# EAGLE design dop (EAGLE 9.4.2)
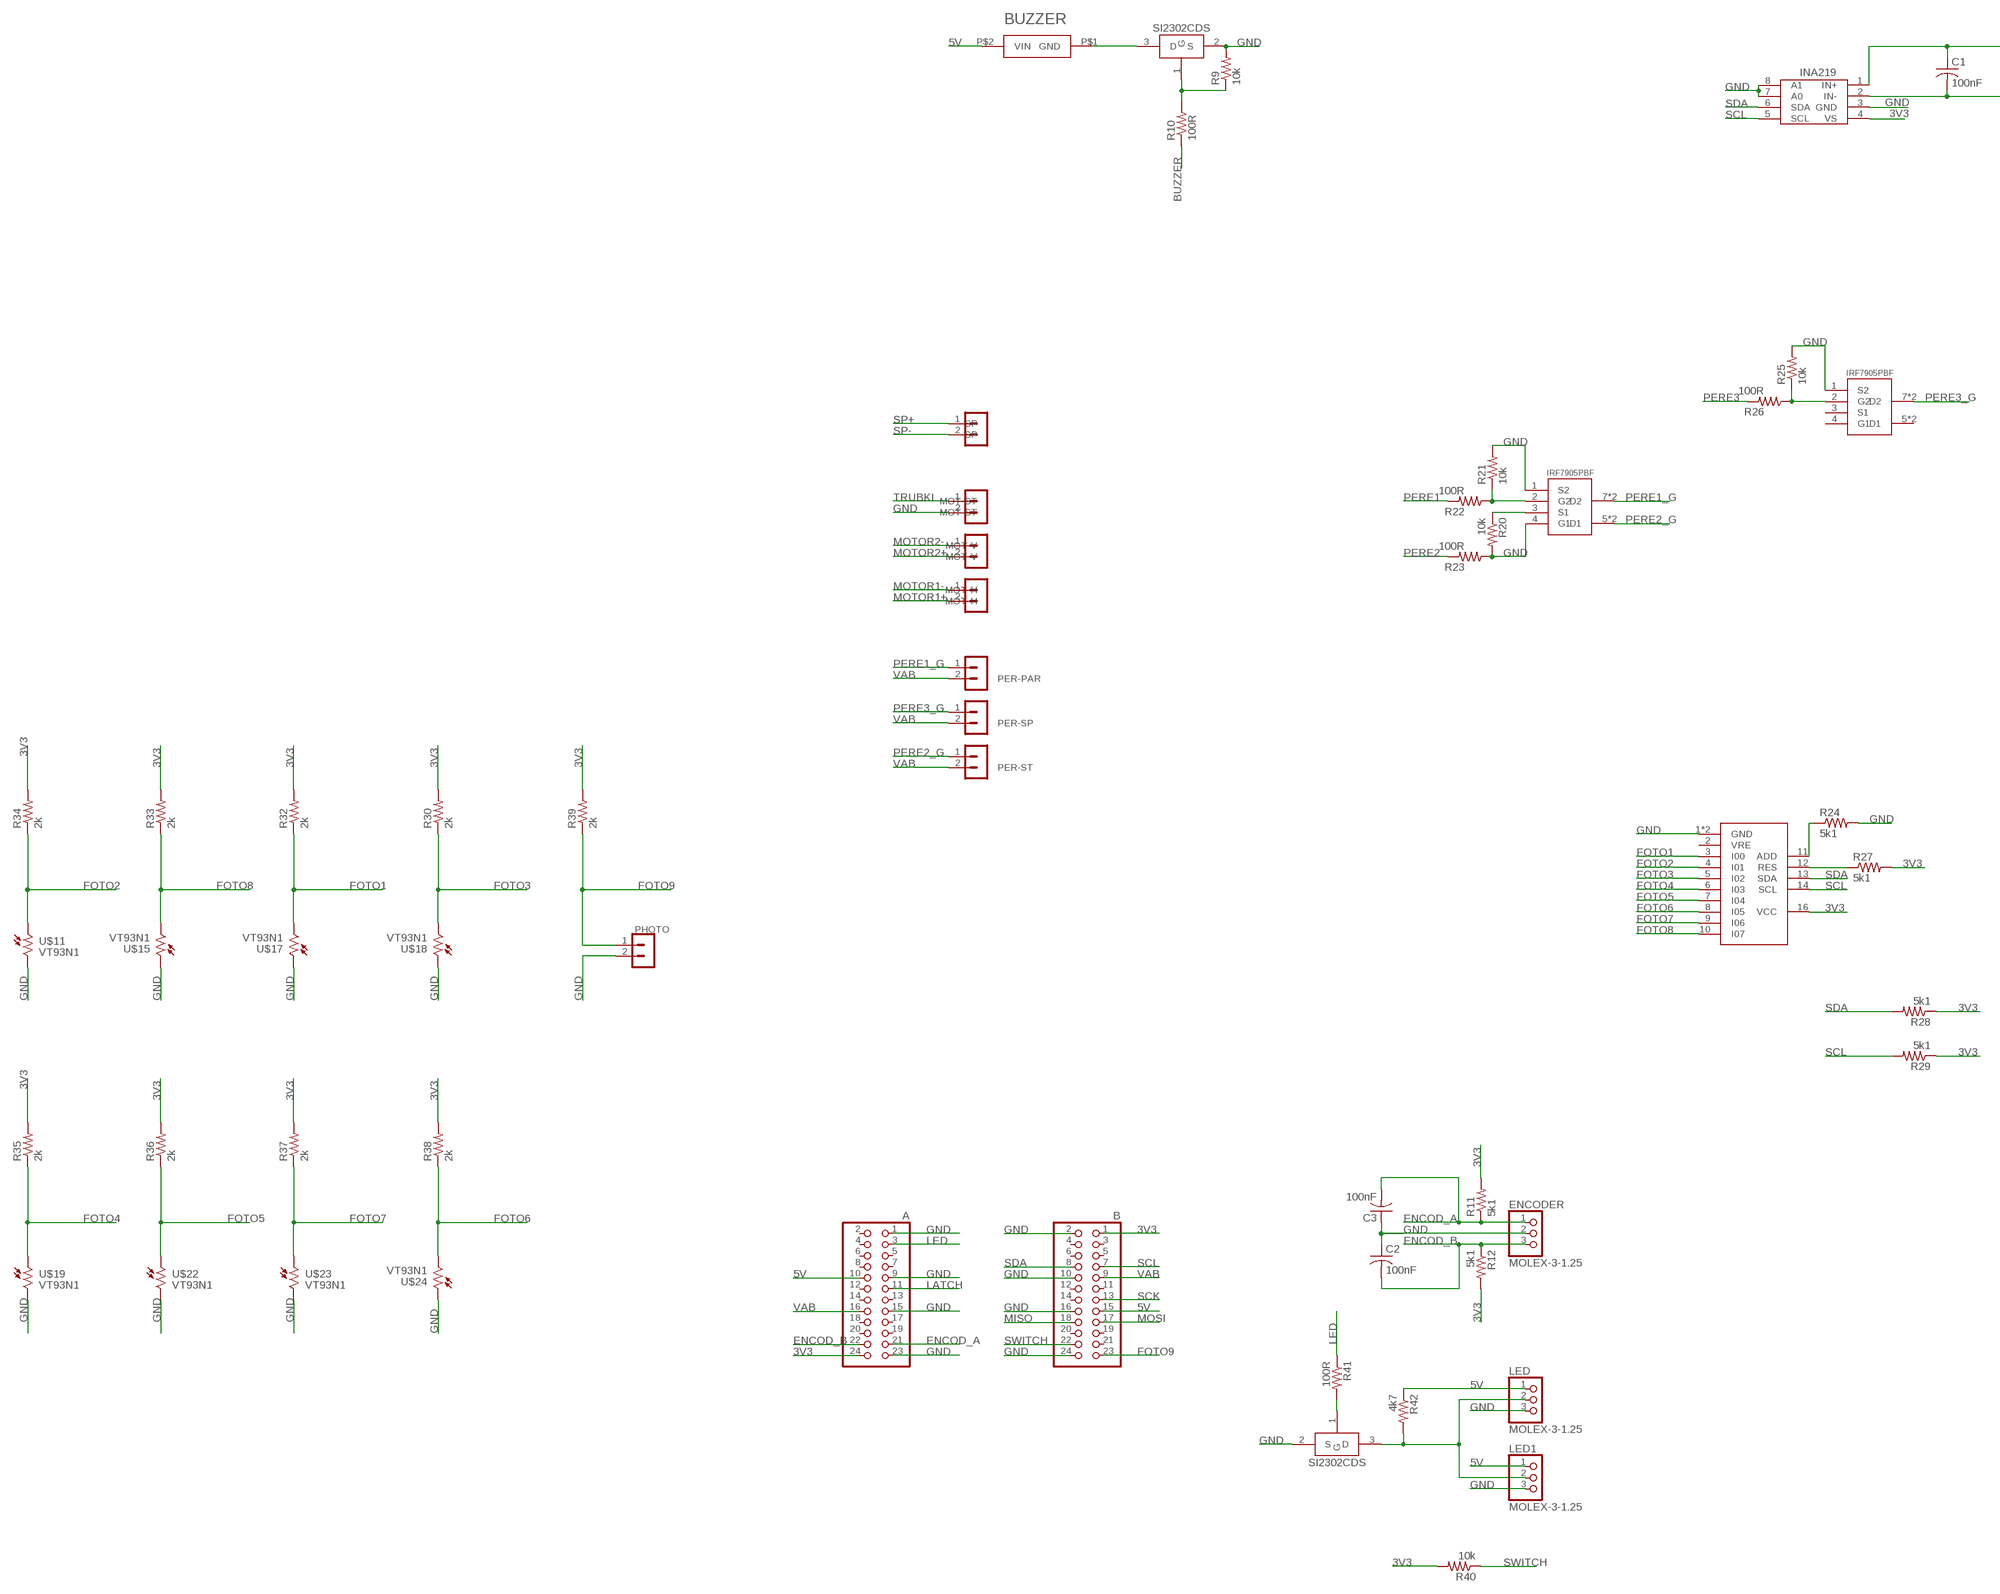
[diagram p0: schematic, sheet 1, part 1 of 2]
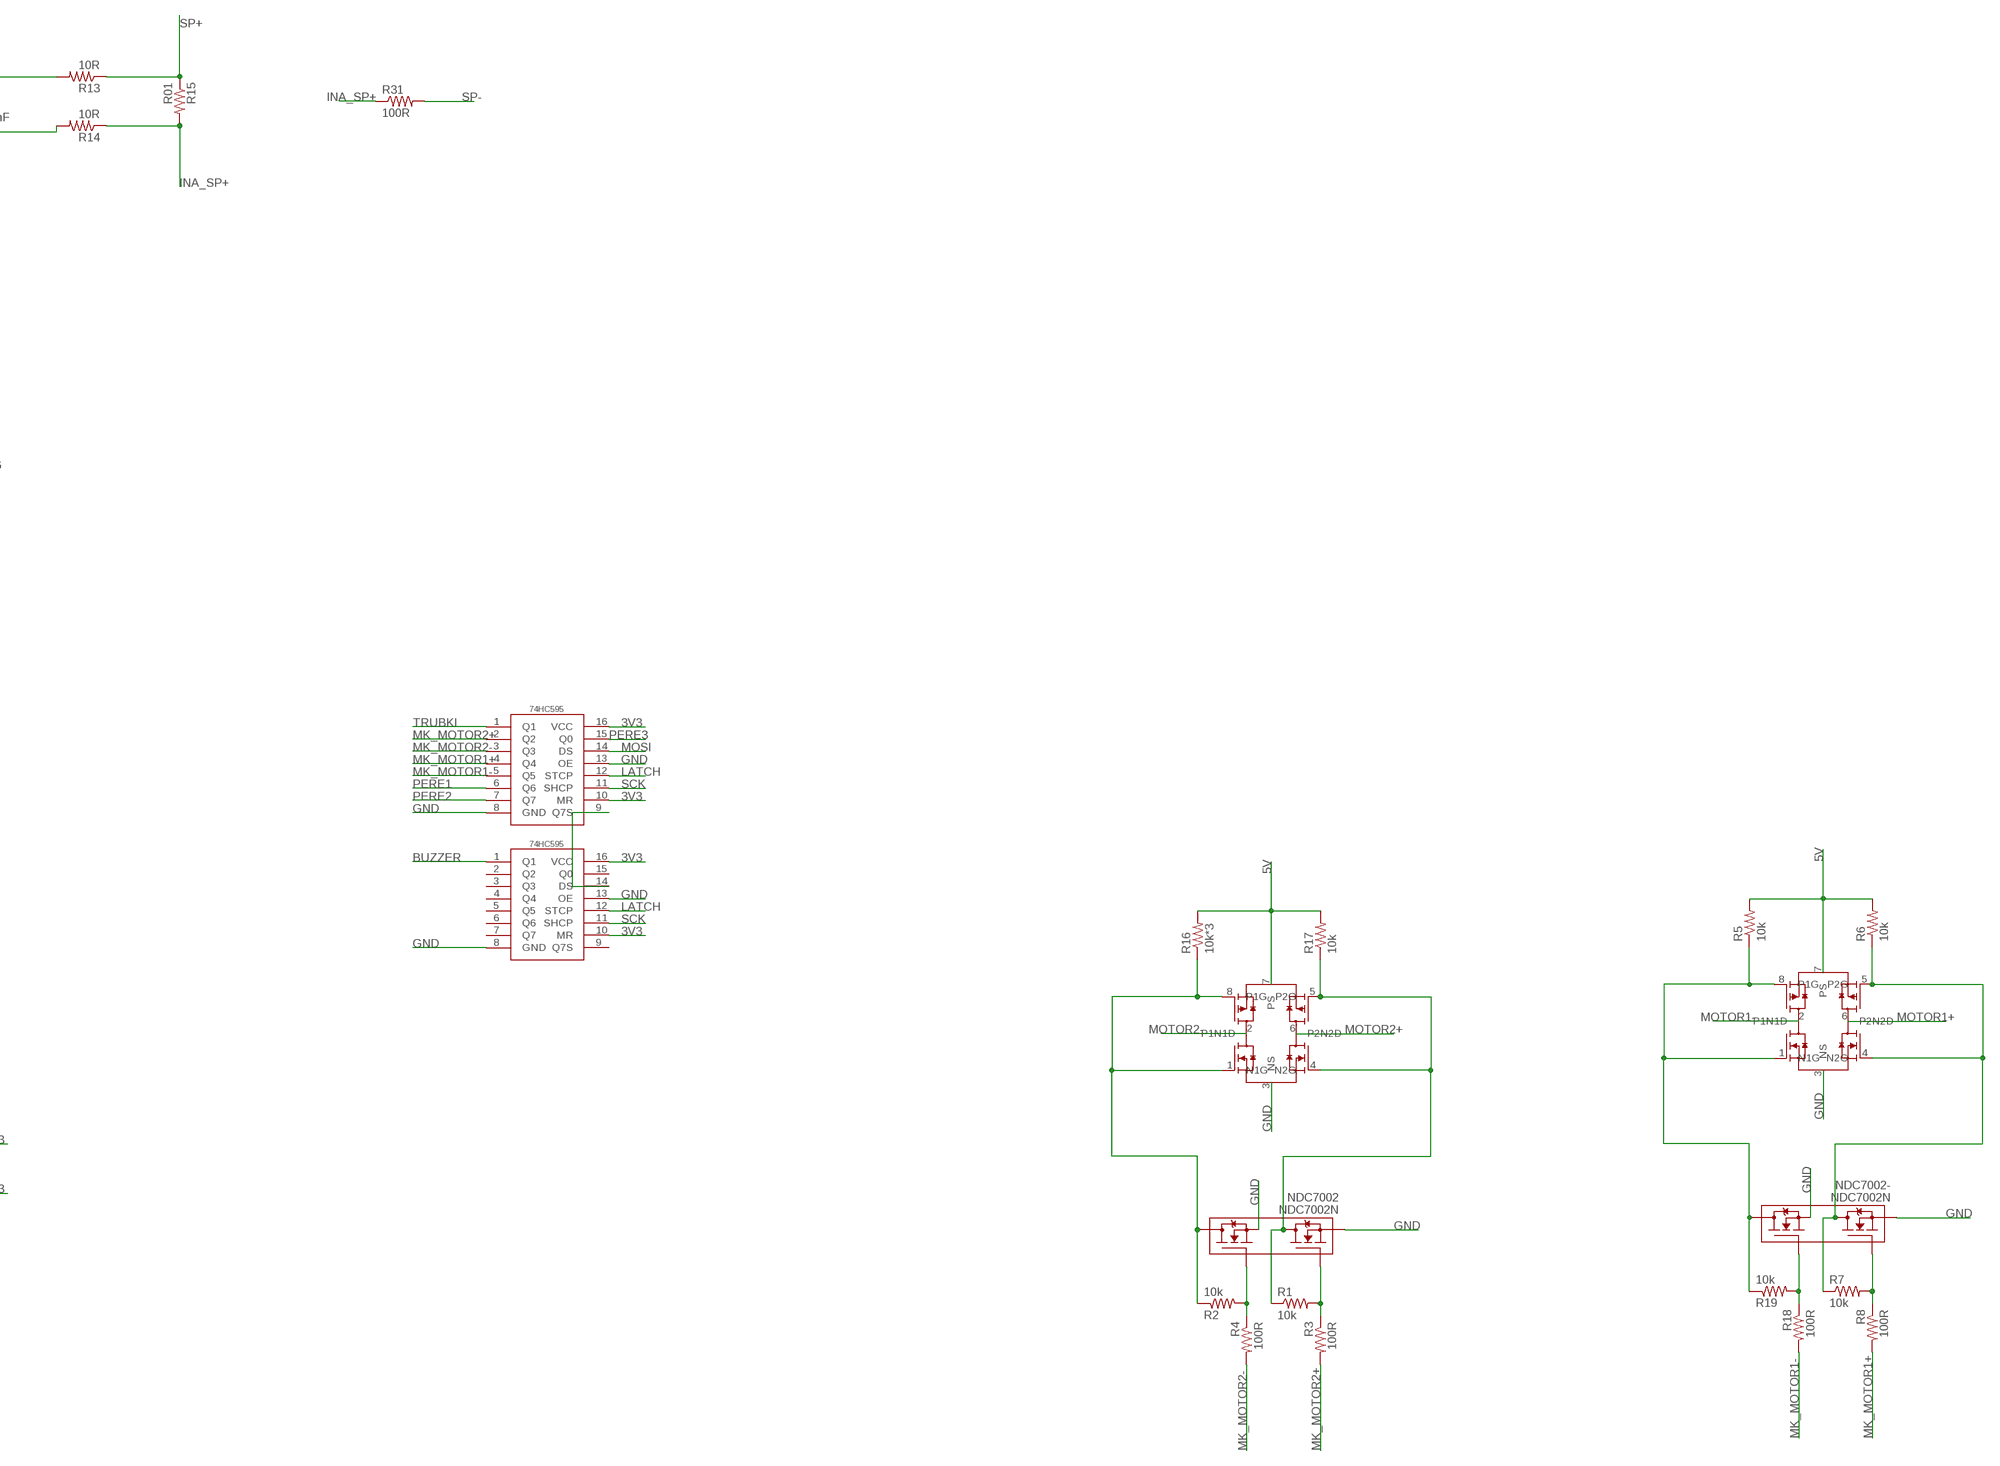
[diagram p1: schematic, sheet 1, part 2 of 2]

## Parts
74HC595  74HC595  [TSSOP16]
74HC595-  74HC595  [TSSOP16]
A  PINHD-2X12  [2X12]
AD5593  AD5593  [AD5593]
AP9930  AP9930GM  [SO8]
AP9930-  AP9930GM  [SO8]
B  PINHD-2X12  [2X12]
BUZZER  BUZZERS8R6  [BUZZER-S8R12]
C1  100nF  C-USC0603  [C0603]
C2  100nF  C-USC0603  [C0603]
C3  100nF  C-USC0603  [C0603]
ENCODER  MOLEX-3-1.25  [53047-03]
INA  INA219AID  [SOT23-8]
IRF7905  IRF7905  [SO8]
IRF7905-  IRF7905  [SO8]
LED  MOLEX-3-1.25  [53047-03]
LED1  MOLEX-3-1.25  [53047-03]
MOT-H  MOLEX-2-1.25  [53047-02]
MOT-ST  MOLEX-2-1.25  [53047-02]
MOT-V  MOLEX-2-1.25  [53047-02]
NDC7002  NDC7002N  [SOT23-6]
NDC7002-  NDC7002N  [SOT23-6]
PER-PAR  JST-2-2.5  [JST-2-2.5]
PER-SP  JST-2-2.5  [JST-2-2.5]
PER-ST  JST-2-2.5  [JST-2-2.5]
PHOTO  MOLEX-2-1.25  [53047-02]
R1  10k  R-US_R0603  [R0603]
R2  10k  R-US_R0603  [R0603]
R3  100R  R-US_R0603  [R0603]
R4  100R  R-US_R0603  [R0603]
R5  10k  R-US_R0603  [R0603]
R6  10k  R-US_R0603  [R0603]
R7  10k  R-US_R0603  [R0603]
R8  100R  R-US_R0603  [R0603]
R9  10k  R-US_R0603  [R0603]
R10  100R  R-US_R0603  [R0603]
R11  5k1  R-US_R0603  [R0603]
R12  5k1  R-US_R0603  [R0603]
R13  10R  R-US_R0603  [R0603]
R14  10R  R-US_R0603  [R0603]
R15  R01  R-US_R2512  [R2512]
R16  10k*3  R-US_R0603  [R0603]
R17  10k  R-US_R0603  [R0603]
R18  100R  R-US_R0603  [R0603]
R19  10k  R-US_R0603  [R0603]
R20  10k  R-US_R0603  [R0603]
R21  10k  R-US_R0603  [R0603]
R22  100R  R-US_R0603  [R0603]
R23  100R  R-US_R0603  [R0603]
R24  5k1  R-US_R0603  [R0603]
R25  10k  R-US_R0603  [R0603]
R26  100R  R-US_R0603  [R0603]
R27  5k1  R-US_R0603  [R0603]
R28  5k1  R-US_R0603  [R0603]
R29  5k1  R-US_R0603  [R0603]
R30  2k  R-US_R0603  [R0603]
R31  100R  R-US_0207/15  [0207/15]
R32  2k  R-US_R0603  [R0603]
R33  2k  R-US_R0603  [R0603]
R34  2k  R-US_R0603  [R0603]
R35  2k  R-US_R0603  [R0603]
R36  2k  R-US_R0603  [R0603]
R37  2k  R-US_R0603  [R0603]
R38  2k  R-US_R0603  [R0603]
R39  2k  R-US_R0603  [R0603]
R40  10k  R-US_R0603  [R0603]
R41  100R  R-US_R0603  [R0603]
R42  4k7  R-US_R0603  [R0603]
SI2302  SI2302CDS  [SOT23-3]
SI2302-  SI2302CDS  [SOT23-3]
SP  MOLEX-2-1.25  [53047-02]
U$11  VT93N1  [VT93N1]
U$15  VT93N1  [VT93N1]
U$17  VT93N1  [VT93N1]
U$18  VT93N1  [VT93N1]
U$19  VT93N1  [VT93N1]
U$22  VT93N1  [VT93N1]
U$23  VT93N1  [VT93N1]
U$24  VT93N1  [VT93N1]

## Nets
3V3: 74HC595-.10(MR) 74HC595-.16(VCC) 74HC595.10(MR) 74HC595.16(VCC) A.24 AD5593.16(VCC) B.1 INA.4(VS) R11.2 R12.2 R27.2 R28.1 R29.1 R30.2 R32.2 R33.2 R34.2 R35.2 R36.2 R37.2 R38.2 R39.2 R40.2
5V: A.10 AP9930-.7(PS) AP9930.7(PS) B.15 BUZZER.P$2(VIN) LED1.1 LED.1 R5.2 R6.2 R16.2 R17.2 R42.1
BUZZER: 74HC595-.1(Q1) R10.1
ENCOD_A: A.21 C3.2 ENCODER.1 R11.1
ENCOD_B: A.22 C2.2 ENCODER.3 R12.1
FOTO1: AD5593.3(I00) R32.1 U$17.P$2
FOTO2: AD5593.4(I01) R34.1 U$11.P$1
FOTO3: AD5593.5(I02) R30.1 U$18.P$2
FOTO4: AD5593.6(I03) R35.1 U$19.P$1
FOTO5: AD5593.7(I04) R36.1 U$22.P$1
FOTO6: AD5593.8(I05) R38.1 U$24.P$2
FOTO7: AD5593.9(I06) R37.1 U$23.P$1
FOTO8: AD5593.10(I07) R33.1 U$15.P$2
FOTO9: B.23 PHOTO.1 R39.1
GND: 74HC595-.8(GND) 74HC595-.13(OE) 74HC595.8(GND) 74HC595.13(OE) A.1 A.9 A.15 A.23 AD5593.1(GND) AD5593.15(GND) AP9930-.3(NS) AP9930.3(NS) B.2 B.10 B.16 B.24 C2.1 C3.1 ENCODER.2 INA.3(GND) INA.7(A0) INA.8(A1) IRF7905-.1(S2) IRF7905.1(S2) IRF7905.4(G1) LED1.3 LED.3 MOT-ST.2 NDC7002-.2(S2) NDC7002-.5(S1) NDC7002.2(S2) NDC7002.5(S1) PHOTO.2 R9.2 R20.2 R21.2 R23.1 R24.2 R25.2 SI2302-.2(S) SI2302.2(S) U$11.P$2 U$15.P$1 U$17.P$1 U$18.P$1 U$19.P$2 U$22.P$2 U$23.P$2 U$24.P$1
INA_SP+: R14.1 R15.2 R31.1
LATCH: 74HC595-.12(STCP) 74HC595.12(STCP) A.11
LED: A.3 R41.1
MISO: B.18
MK_MOTOR1+: 74HC595.4(Q4) R8.2
MK_MOTOR1-: 74HC595.5(Q5) R18.2
MK_MOTOR2+: 74HC595.2(Q2) R3.2
MK_MOTOR2-: 74HC595.3(Q3) R4.2
MOSI: 74HC595.14(DS) B.17
MOTOR1+: AP9930-.6(P2N2D) MOT-H.2
MOTOR1-: AP9930-.2(P1N1D) MOT-H.1
MOTOR2+: AP9930.6(P2N2D) MOT-V.2
MOTOR2-: AP9930.2(P1N1D) MOT-V.1
N$1: NDC7002.3(G2) R1.2 R3.1
N$2: AP9930.1(N1G) AP9930.8(P1G) NDC7002.6(D1) R2.1 R16.1
N$3: NDC7002.1(G1) R2.2 R4.1
N$4: AP9930.4(N2G) AP9930.5(P2G) NDC7002.4(D2) R1.1 R17.1
N$5: AP9930-.1(N1G) AP9930-.8(P1G) NDC7002-.6(D1) R5.1 R19.1
N$6: NDC7002-.3(G2) R7.2 R8.1
N$7: NDC7002-.1(G1) R18.1 R19.2
N$8: AP9930-.4(N2G) AP9930-.5(P2G) NDC7002-.4(D2) R6.1 R7.1
N$9: IRF7905.3(S1) R20.1
N$12: IRF7905.2(G2) R21.1 R22.1
N$13: BUZZER.P$1(GND) SI2302-.3(D)
N$14: R9.1 R10.2 SI2302-.1(G)
N$15: C1.1 INA.1(IN+) R13.2
N$16: C1.2 INA.2(IN-) R14.2
N$17: R41.2 SI2302.1(G)
N$18: AD5593.12(RES) R27.1
N$20: AD5593.11(ADD) R24.1
N$21: IRF7905-.2(G2) R25.1 R26.1
N$22: 74HC595-.14(DS) 74HC595.9(Q7S)
N$23: LED1.2 LED.2 R42.2 SI2302.3(D)
PERE1: 74HC595.6(Q6) R22.2
PERE1_G: IRF7905.7(D2) IRF7905.8(D2) PER-PAR.1
PERE2: 74HC595.7(Q7) R23.2
PERE2_G: IRF7905.5(D1) IRF7905.6(D1) PER-ST.1
PERE3: 74HC595.15(Q0) R26.2
PERE3_G: IRF7905-.7(D2) IRF7905-.8(D2) PER-SP.1
SCK: 74HC595-.11(SHCP) 74HC595.11(SHCP) B.13
SCL: AD5593.14(SCL) B.7 INA.5(SCL) R29.2
SDA: AD5593.13(SDA) B.8 INA.6(SDA) R28.2
SP+: R13.1 R15.1 SP.1
SP-: R31.2 SP.2
SWITCH: B.22 R40.1
TRUBKI: 74HC595.1(Q1) MOT-ST.1
VAB: A.16 B.9 PER-PAR.2 PER-SP.2 PER-ST.2
Unconnected: 74HC595-.2(Q2) 74HC595-.3(Q3) 74HC595-.4(Q4) 74HC595-.5(Q5) 74HC595-.6(Q6) 74HC595-.7(Q7) 74HC595-.9(Q7S) 74HC595-.15(Q0) A.2 A.4 A.5 A.6 A.7 A.8 A.12 A.13 A.14 A.17 A.18 A.19 A.20 AD5593.2(VRE) B.3 B.4 B.5 B.6 B.11 B.12 B.14 B.19 B.20 B.21 IRF7905-.3(S1) IRF7905-.4(G1) IRF7905-.5(D1) IRF7905-.6(D1)

## Library data of the parts
74HC595 74HC595- = CanCubeSat:74HC595
A B = pinhead:PINHD-2X12: PIN HEADER
AD5593 = CanCubeSat:AD5593
AP9930 AP9930- = CanCubeSat:AP9930GM
BUZZER = CanCubeSat:BUZZER
C1-C3 = rcl:C-US: CAPACITOR, American symbol; SPICEPREFIX: C
ENCODER LED LED1 = CanCubeSat:MOLEX-3-1.25
INA = CanCubeSat:INA219AID
IRF7905 IRF7905- = CanCubeSat:IRF7905
MOT-H MOT-ST MOT-V PHOTO SP = CanCubeSat:MOLEX-2-1.25
NDC7002 NDC7002- = CanCubeSat:NDC7002N
PER-PAR PER-SP PER-ST = CanCubeSat:JST-2-2.5: JST PH series header 2.00mm pitch disconnectable crimp style connectors, vertical (side entry type), 2 pins
R1-R30 R32-R42 = rcl:R-US_: RESISTOR, American symbol; SPICEPREFIX: R
R31 = CanCubeSat:R-US_: RESISTOR, American symbol; SPICEPREFIX: R
SI2302 SI2302- = CanCubeSat:SI2302CDS
U$11 U$15 U$17-U$19 U$22-U$24 = KNPN-2023:VT93N1

## Board
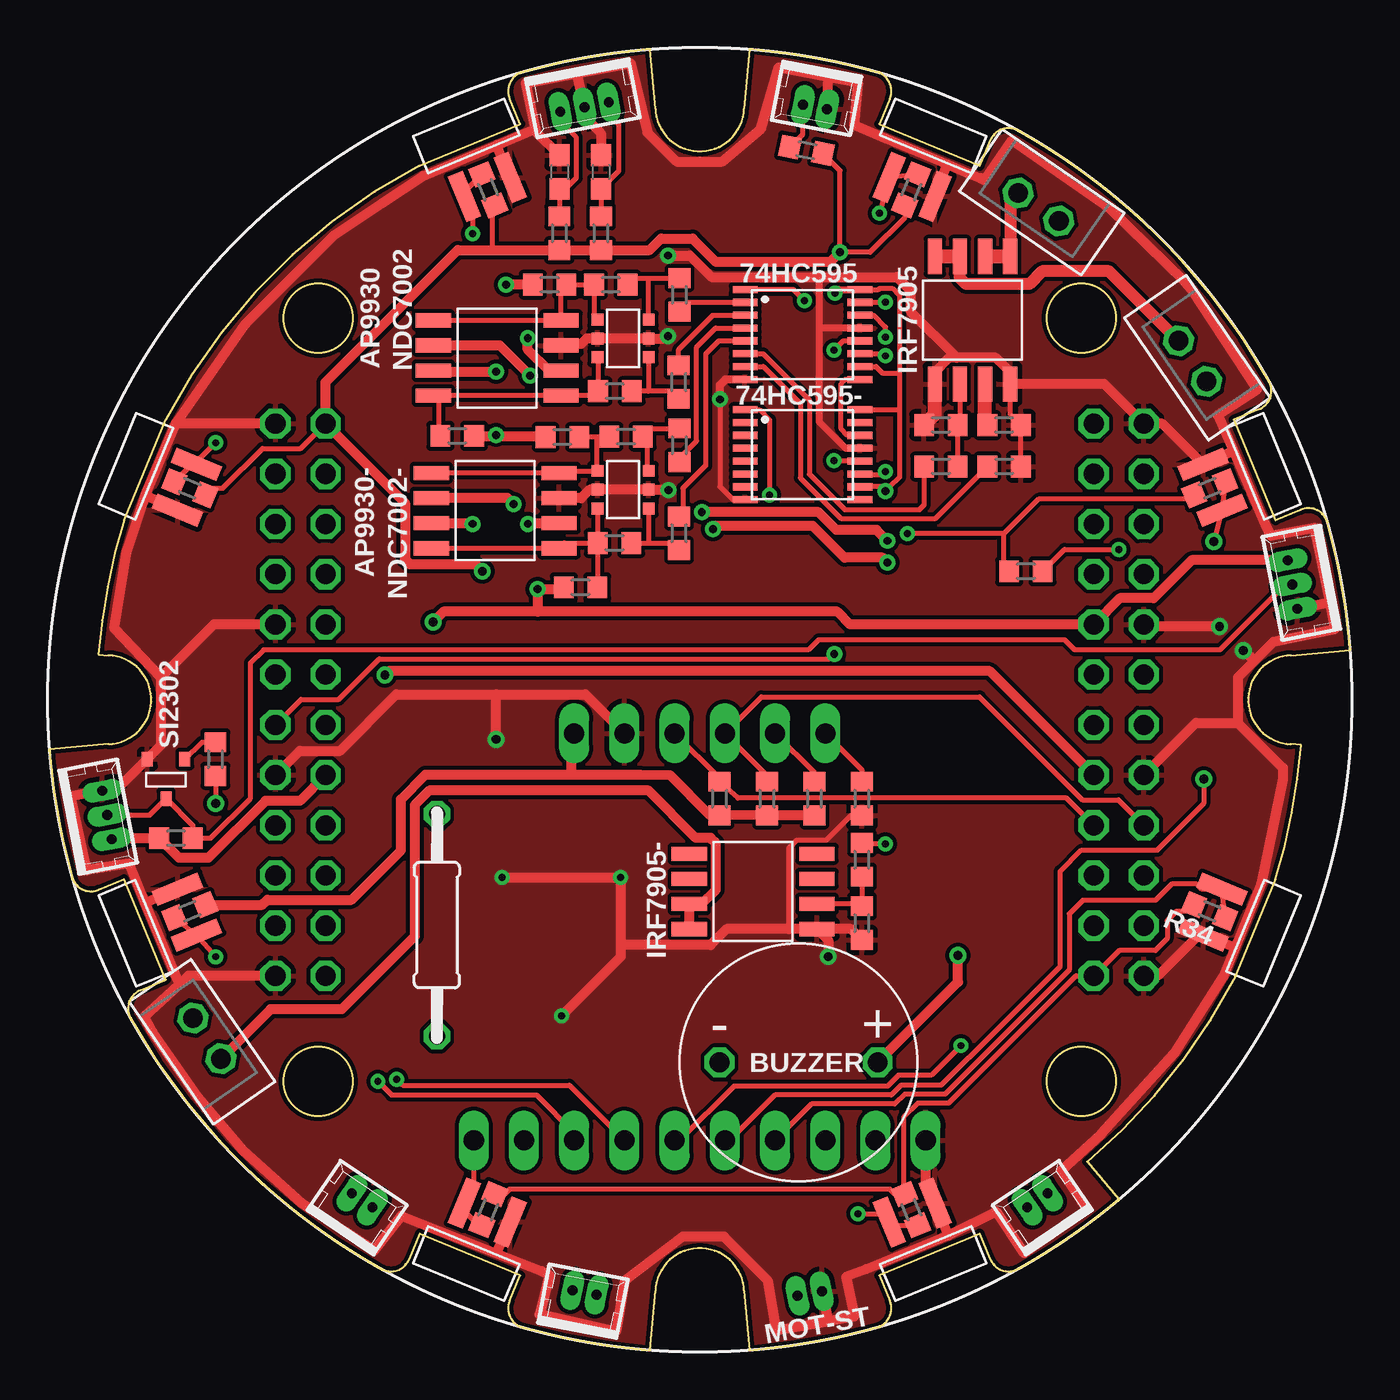
[diagram p2: board, top side]
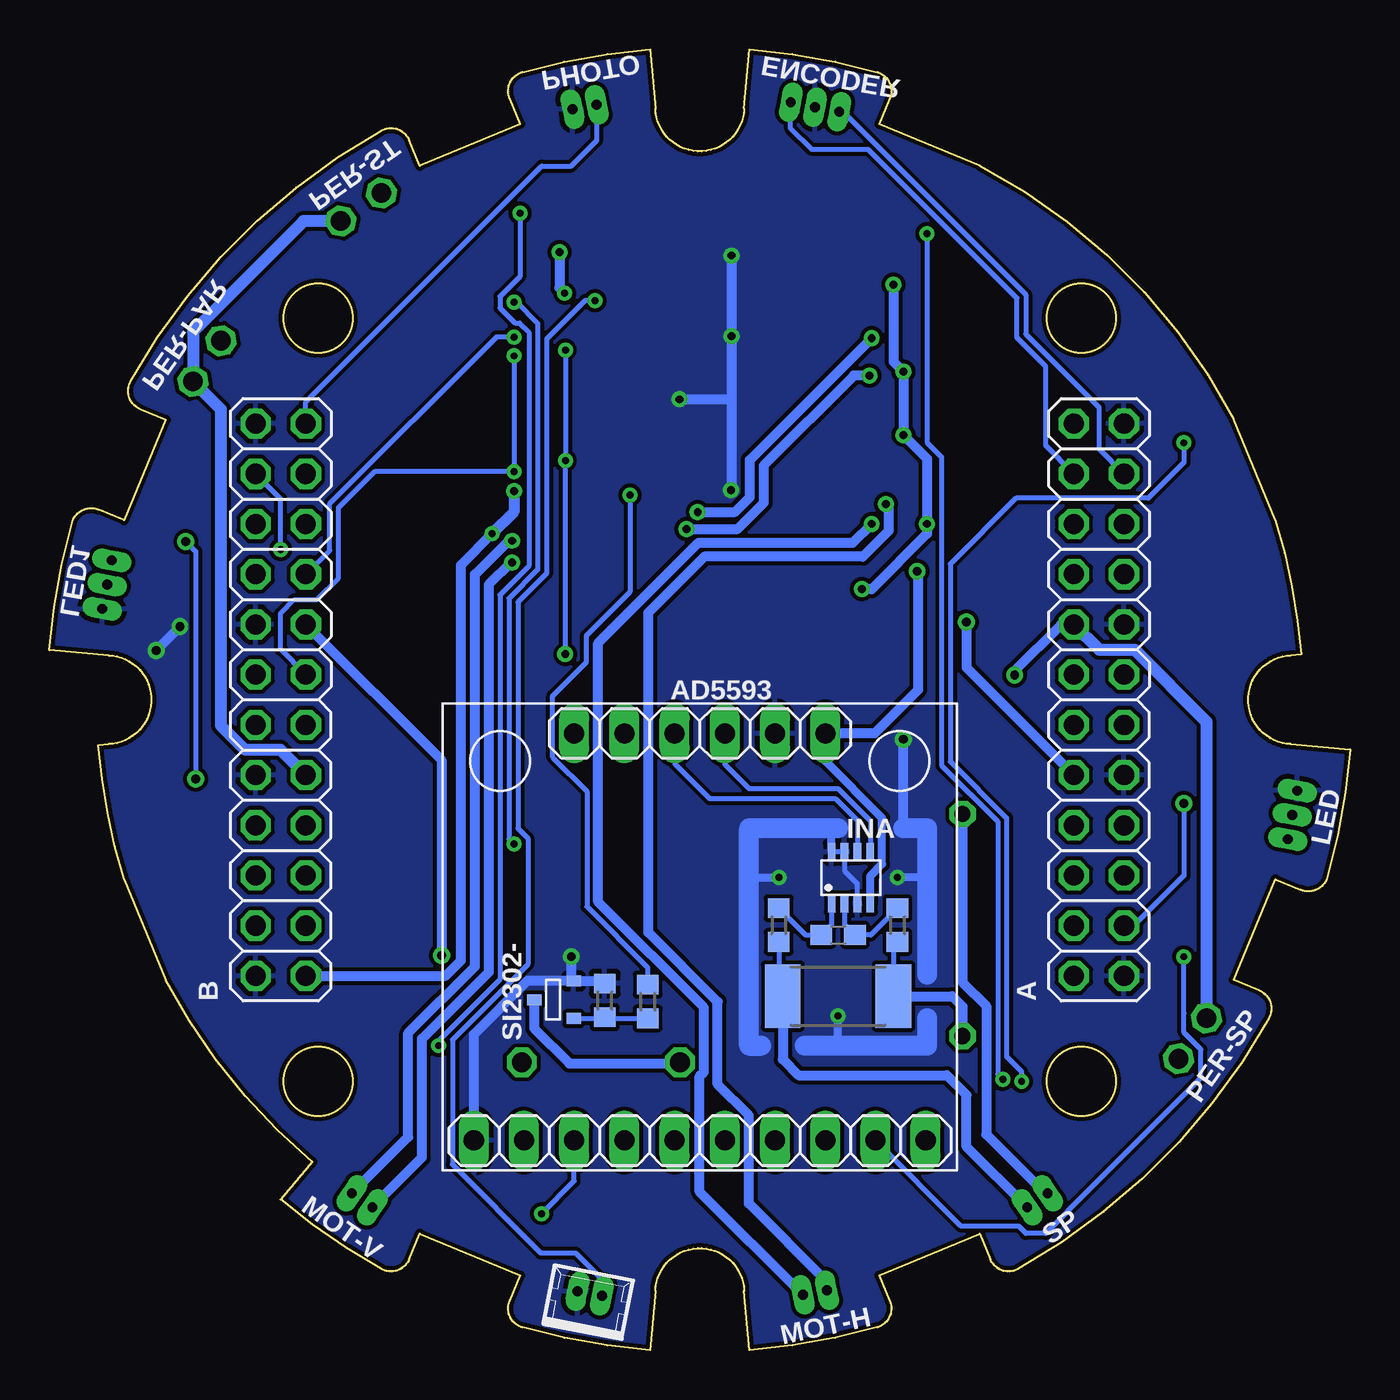
[diagram p3: board, bottom side, seen from below]

Size 65.81 x 65.81 mm. Coordinates in mm from the lower left corner, seen from the top.
Outline: 3.78,41.99 5.88,47.07 arc-35 18.74,59.92 23.82,62.03 23.28,63.32 arc-97 23.94,64.66 arc-11 30.39,65.81 30.66,62.82 arc176 35.15,62.82 35.41,65.81 arc-11 41.87,64.66 arc-97 42.53,63.32 41.99,62.03 47.07,59.92 47.61,61.21 arc-97 49.02,61.7 arc-32 61.7,49.02 arc-97 61.21,47.61 59.92,47.07 62.03,41.99 63.32,42.53 arc-97 64.66,41.87 arc-11 65.81,35.41 62.82,35.15 arc176 62.82,30.66 63.33,30.61 arc-13 62.03,23.82 59.92,18.74 arc-22 52.52,9.53 54.12,7.63 arc-11 49.02,4.11 arc-97 47.61,4.6 47.07,5.88 41.99,3.78 42.53,2.49 arc-97 41.87,1.15 arc-11 35.41,0 35.15,2.99 arc176 30.66,2.99 30.39,0 arc-11 23.94,1.15 arc-97 23.28,2.49 23.82,3.78 18.74,5.88 18.2,4.6 arc-97 16.79,4.11 arc-32 4.11,16.79 arc-97 4.6,18.2 5.88,18.74 3.78,23.82 2.49,23.28 arc-97 1.15,23.94 arc-11 0,30.39 2.99,30.66 arc176 2.99,35.15 2.48,35.2 arc-13 3.78,41.99
Outline: circle at 13.6,13.6 radius 1.75
Outline: circle at 52.2,13.6 radius 1.75
Outline: circle at 52.2,52.2 radius 1.75
Outline: circle at 13.6,52.2 radius 1.75
Copper layers (1*16): Top 0.035mm / dielectric 1.5mm / Bottom 0.035mm
Design rules "default *": minimum track width 0.25mm, minimum drill 0.35mm, track to track 0.2mm, track to pad 0.2mm, pad to pad 0.2mm, via to via 0.2mm, smd to smd 0.2mm, copper to edge 0.2mm, drill to drill 0.1mm, minimum pad ring 10mil, minimum via ring 8mil, stop-mask expansion 3mil, vias tented up to drill 0mil, thermal gap 10mil

### Footprints (pad centres in the part's own frame; a part is rotated, then mirrored left to right if it is on the bottom)
TSSOP16 = smd 1.26 x 0.36: 1 -2.9,2.275; 2 -2.9,1.625; 3 -2.9,0.975; 4 -2.9,0.325; 5 -2.9,-0.325; 6 -2.9,-0.975; 7 -2.9,-1.625; 8 -2.9,-2.275; 9 2.9,-2.275; 10 2.9,-1.625; 11 2.9,-0.975; 12 2.9,-0.325; 13 2.9,0.325; 14 2.9,0.975; 15 2.9,1.625; 16 2.9,2.275
2X12 = drill 1.016 octagon: 1 -13.97,-1.27; 2 -13.97,1.27; 3 -11.43,-1.27; 4 -11.43,1.27; 5 -8.89,-1.27; 6 -8.89,1.27; 7 -6.35,-1.27; 8 -6.35,1.27; 9 -3.81,-1.27; 10 -3.81,1.27; 11 -1.27,-1.27; 12 -1.27,1.27; 13 1.27,-1.27; 14 1.27,1.27; 15 3.81,-1.27; 16 3.81,1.27; 17 6.35,-1.27; 18 6.35,1.27; 19 8.89,-1.27; 20 8.89,1.27; 21 11.43,-1.27; 22 11.43,1.27; 23 13.97,-1.27; 24 13.97,1.27
AD5593 = drill 1.016 long: 1 -11.43,-10.3; 2 -8.89,-10.3; 3 -6.35,-10.3; 4 -3.81,-10.3; 5 -1.27,-10.3; 6 1.27,-10.3; 7 3.81,-10.3; 8 6.35,-10.3; 9 8.89,-10.3; 10 11.43,-10.3; 11 -6.35,10.3; 12 -3.81,10.3; 13 -1.27,10.3; 14 1.27,10.3; 15 3.81,10.3; 16 6.35,10.3
SO8 = smd 0.72 x 1.78: 1 -1.905,-3.23; 2 -0.635,-3.23; 3 0.635,-3.23; 4 1.905,-3.23; 5 1.905,3.23; 6 0.635,3.23; 7 -0.635,3.23; 8 -1.905,3.23
BUZZER-S8R12 = drill 1 octagon: P$1 -4,0; P$2 4,0
C0603 = smd 1.1 x 1: 1 -0.85,0; 2 0.85,0
53047-03 = drill 0.5 pad 0.698 long: 1 1.25,0.45; 2 0,0.45; 3 -1.25,0.45
SOT23-8 = smd 0.9 x 0.4: 1 -1.3,0.975; 2 -1.3,0.325; 3 -1.3,-0.325; 4 -1.3,-0.975; 5 1.3,-0.975; 6 1.3,-0.325; 7 1.3,0.325; 8 1.3,0.975
53047-02 = drill 0.5 pad 0.698 long: 1 0.625,0.45; 2 -0.625,0.45
SOT23-6 = smd 0.6 x 0.6: 1 -0.95,-1.3; 2 0,-1.3; 3 0.95,-1.3; 4 0.95,1.3; 5 0,1.3; 6 -0.95,1.3
JST-2-2.5 = drill 1 pad 1.5 octagon: 1 1.25,0; 2 -1.25,0
R0603 = smd 1 x 1.1: 1 -0.85,0; 2 0.85,0
R2512 = smd 1.8 x 3.2: 1 -2.8,0; 2 2.8,0
0207/15 = drill 0.813 octagon: 1 -5.62,0; 2 5.62,0
SOT23-3 = smd 0.56 x 0.73: 1 -0.95,-1; 2 0.95,-1; 3 0,1
VT93N1 = smd 0.8 x 2.5: P$1 -1.25,-1.8; P$2 1.25,-1.8

### Placement (x,y rotation side)
74HC595  38.1,51.38 0 top
74HC595-  38.1,45.3 0 top
A  12.7,32.9 90 bottom
AD5593  32.9,20.9 0 bottom
AP9930  22.65,50.19 90 top
AP9930-  22.55,42.47 90 top
B  54.1,32.9 90 bottom
BUZZER  37.9,14.55 0 top
C1  25.9,21 0 bottom
C2  27.9,59.6 270 top
C3  25.8,59.6 270 top
ENCODER  26.99,63.33 191 top
INA  25.25,23.9 90 bottom
IRF7905  46.7,52.1 0 top
IRF7905-  35.6,23.2 90 top
LED  2.47,26.99 281 top
LED1  63.33,38.82 101 top
MOT-H  26.99,2.47 349 top
MOT-ST  38.55,2.42 349 bottom
MOT-V  50.24,7.2 34 top
NDC7002  29.02,51.18 90 top
NDC7002-  29.02,43.53 90 top
PER-PAR  57.83,50.04 124.5 top
PER-SP  7.97,15.77 304.5 top
PER-ST  50.04,57.83 145.5 top
PHOTO  38.82,63.33 169 top
R1  28.4,53.9 0 top
R2  28.61,48.51 0 top
R3  31.87,53.38 270 top
R4  31.83,48.97 90 top
R5  26.87,38.59 180 top
R6  25.95,46.19 180 top
R7  29.17,46.21 0 top
R8  31.87,45.78 270 top
R9  37.71,17.69 90 bottom
R10  35.53,17.63 270 bottom
R11  25.8,56.5 270 top
R12  27.9,56.5 270 top
R13  28.9,21.5 90 bottom
R14  22.9,21.5 90 bottom
R15  25.9,17.9 0 bottom
R16  20.63,46.25 0 top
R17  25.3,53.9 180 top
R18  31.85,41.32 90 top
R19  28.59,40.83 0 top
R20  48.3,46.8 0 top
R21  45.1,46.8 180 top
R22  45.1,44.7 180 top
R23  48.3,44.7 180 top
R24  41.1,27.9 270 top
R25  41.1,21.6 270 top
R26  41.1,24.8 90 top
R27  38.7,27.9 270 top
R28  36.3,27.9 90 top
R29  33.9,27.9 90 top
R30  58.7,43.6 202.5 top
R31  19.6,21.5 90 top
R32  43.6,7.1 112.5 top
R33  22.2,7.1 67.5 top
R34  58.7,22.2 157.5 top
R35  43.6,58.7 247.5 top
R36  22.2,58.7 292.5 top
R37  7.1,22.2 22.5 top
R38  7.1,43.6 337.5 top
R39  38.3,60.7 349 top
R40  49.4,39.4 180 top
R41  8.4,29.9 90 top
R42  6.4,25.9 0 top
SI2302  5.9,28.9 180 top
SI2302-  40.28,17.72 90 bottom
SP  15.57,7.2 326 top
U$11  60.51,21.47 247.5 top
U$15  21.47,5.29 157.5 top
U$17  44.34,5.29 202.5 top
U$18  60.51,44.34 292.5 top
U$19  44.34,60.51 337.5 top
U$22  21.47,60.51 22.5 top
U$23  5.29,21.47 112.5 top
U$24  5.29,44.34 67.5 top

### Tracks (layer width: path | path; a pad name or v marks a point on that pad's centre or on a via)
3V3  (via drill 0.35, 0.4, 0.45)
  Top 0.25: R34.2 57.59,22.2 57.03,22.2 56.56,21.74 56.56,20.82 55.96,20.22 54.12,20.22 B.1 51.93,18.93 47.9,14.9 45.5,12.5 43.93,12.5 43.25,11.82 43.25,7.92 R32.2 42.78,7.89 42.53,8.14 23.27,8.14 23.03,7.89 R33.2 | 43.02,47.58 43.02,44.16 42.54,43.68 42.4,43.68 | 74HC595-.16 43.02,47.58 | 42.4,43.68 74HC595-.10 | 43.02,49.44 43.02,53.35 42.64,53.72 42.01,53.72 41.95,53.66 74HC595.16 | 43.02,49.44 43.02,47.58 | 74HC595.10 41.82,49.76 42.14,49.44 43.02,49.44 | 42.4,43.68 42.4,43.57 v42.3,43.47 | R35.2 43.28,57.3 41.52,55.55 v40,55.55 40,59.68 R39.2 | R38.2 8.22,43.61 8.77,43.61 10.78,45.62 12.72,45.62 A.24 | R36.2 22.4,57.79 22.4,55.65 | 48.3,41.3 50.05,43.05 57.69,43.05 R30.2 | 48.3,41.3 v43.4,41.3 | R40.2 48.3,39.65 48.3,41.3 | R39.2
  Top 0.35: v39.73,53.47 39.93,53.66 74HC595.16
  Top 0.5: R27.2 R28.1 33.99,27.06 R29.1 33.43,27.06 31.39,29.1 29.9,29.11 26.4,29.11 | v40,55.55 39.5,55.05 33.74,55.05 32.55,56.24 30.95,56.24 30.37,55.65 R12.2 R11.2 22.4,55.65 20.65,55.65 13.97,48.97 A.24 17.98,42.86 17.98,40.02 18.25,39.76 21.55,39.76 v21.9,39.4 | R37.2 10.78,22.53 11.03,22.79 15.29,22.79 17.79,25.29 17.79,27.87 19.03,29.11 26.4,29.11 | AD5593.16 26.4,31.2 26.4,29.11
  Bottom 0.4: INA.4 24.28,23.99 23.68,24.59 23.68,26.92 26.55,29.8 AD5593.16
  Bottom 0.5: v43.4,41.3 45,39.71 45,19.69 45.76,18.93 B.1 | v40,55.55 40,53.74 v39.73,53.47 | v21.9,39.4 21.85,39.35 21.85,33.4 24.05,31.2 AD5593.16
  Bottom 0.55: v42.3,43.47 42.3,42.4 v43.4,41.3
5V  (via drill 0.4, 0.45)
  Top 0.25: AP9930.7 19.48,49.5
  Top 0.5: R17.2 v23.1,53.9 | 19.48,49.5 v22.6,49.5 | R16.2 22.6,46.25 | 22.6,46.25 25.04,46.25 R6.2 | 22.6,46.25 v22.6,46.3 | AP9930-.7 21.37,41.84 v21.4,41.8 | R5.2 25.93,38.5 v24.7,38.5 24.7,37.36 | LED.1 3.21,25.9 R42.1 6.55,24.9 8.04,24.9 10.93,27.79 12.67,27.79 A.10 | LED1.1 57.79,39.96 55.88,38.04 54.16,38.04 B.15 40.51,36.71 39.86,37.36 24.7,37.36 | BUZZER.P$2 45.97,18.62 v45.97,19.97 | 24.7,37.36 19.94,37.36 v19.4,36.83
  Bottom 0.5: v23.1,53.9 23.1,50 v22.6,49.5 v22.6,46.3 21.4,45.1 v21.4,41.8 21.4,41.3 24.2,38.5 v24.7,38.5 | B.15 45.97,29.85 v45.97,19.97 | v19.4,36.83 19.4,34.52 A.10
BUZZER  (via drill 0.35)
  Top 0.25: v36.44,43.25 36.44,47.07 35.92,47.58 74HC595-.1
  Bottom 0.25: v36.44,43.25 36.44,38.35 38.64,36.14 38.64,34.8 40.34,33.1 40.34,29.99 38.62,28.27 38.62,22.44 35.53,19.36 R10.1
ENCOD_A
  Top 0.25: R11.1 C3.2 26.1,58.75 26.65,59.3 26.65,61.35 25.85,62.15 ENCODER.1
  Bottom 0.25: ENCODER.1 25.65,62.65 16.4,53.41 16.4,51.4 12.7,47.7 12.7,45.6 A.21
ENCOD_B
  Top 0.25: ENCODER.3 28.3,62.53 28.8,62.03 28.8,59.65 C2.2 R12.1
  Bottom 0.25: A.22 15.4,45.76 15.4,49.77 16.85,51.22 16.85,53.22 24.37,60.74 27.24,60.74 28.3,61.8 ENCODER.3
FOTO1  (via drill 0.35)
  Top 0.25: v40.9,6.9 42.07,6.9 U$17.P$2 42.66,6.32 R32.1
  Bottom 0.25: v40.9,6.9 39.25,8.55 AD5593.3
FOTO2
  Top 0.25: R34.1 U$11.P$1 58.32,23.31 58.05,23.58 56.78,23.58 55.96,22.76 52.28,22.76 51.6,22.07 51.6,19.23 45.31,12.95 43.28,12.95 42.78,12.45 38.56,12.45 AD5593.4
FOTO3  (via drill 0.45)
  Top 0.25: AD5593.5 34.42,10.6 36.71,12.9 42.59,12.9 43.09,13.4 45.12,13.4 46.51,14.79 46.52,14.79 51.15,19.42 51.15,24.22 52.22,25.3 56.06,25.3 58.4,27.65 v58.4,28.9 | R30.1 U$18.P$2 v58.9,40.9
  Bottom 0.25: v58.9,40.9 58.4,40.4 v58.4,28.9
FOTO4  (via drill 0.35)
  Top 0.25: AD5593.6 31.88,10.6 34.62,13.35 42.4,13.35 42.96,13.9 44.62,13.9 v46.12,15.4 | R35.1 U$19.P$1 v42,57.52
  Bottom 0.25: v42,57.52 42,54.31 43.01,53.31 43.01,52.73 42.25,51.96 42.01,51.96 41.55,51.5 41.55,39.67 43.01,38.21 43.01,18.75 46.12,15.63 v46.12,15.4
FOTO5  (via drill 0.35)
  Top 0.25: v17.58,13.7 17.88,13.4 26.31,13.4 29.09,10.62 AD5593.7 | R36.1 21,58.61 U$22.P$1 21.4,57.97 v21.4,56.48
  Bottom 0.25: v17.58,13.7 17.83,13.96 17.83,26.74 20.68,29.59 20.68,45.19 21.4,45.92 v21.4,56.48
FOTO6  (via drill 0.35)
  Top 0.25: AD5593.8 26.55,11 24.65,12.9 17.31,12.9 v16.62,13.59 | v8.4,45.9 7.44,44.94 | 7.44,44.94 U$24.P$2 | R38.1 7.32,44.94 7.44,44.94
  Bottom 0.25: v8.4,45.9 8.4,44.9 10.2,43.1 16.9,43.1 20.23,39.78 20.23,29.78 17.38,26.93 17.38,14.85 16.62,14.09 v16.62,13.59
FOTO7  (via drill 0.35)
  Top 0.25: R37.1 U$23.P$1 v8.4,19.9
  Bottom 0.25: AD5593.9 19.68,6.27 16.77,6.27 16.4,5.9 15.4,5.9 14.34,6.97 14.27,7.01 14.27,7.04 7.54,13.77 7.54,15.21 8.4,16.08 8.4,17.02 8.41,17.04 8.4,17.05 v8.4,19.9
FOTO8
  Top 0.25: R33.1 21.73,6.32 20.89,7.16 21,7.27 U$15.P$2 21,8 21.47,8.47 AD5593.10
FOTO9
  Top 0.25: R39.1 38.12,61.52 PHOTO.1
  Bottom 0.25: B.23 52.83,47.97 40.9,59.9 39.4,59.9 38.1,61.2 38.1,63 PHOTO.1
GND  (via drill 0.35, 0.4, 0.45)
  Top 0.25: 30.35,43.5 NDC7002-.2 | R23.1 R20.2 48.61,47.35 IRF7905.4 | v33.93,48.1 33.93,43.69 34.58,43.03 74HC595-.8 | R24.2 40.55,27.05 39.29,25.79 37.81,25.79 37.4,25.39 37.4,21.3
  Top 0.35: 74HC595-.13 40.28,45.63 38.95,46.96 38.95,51.71 | 74HC595.13 38.95,51.71 | 38.95,51.71 38.95,54.25 38.9,54.3
  Top 0.4: 74HC595.8 34.2,49.11 33.93,48.83 v33.93,48.1
  Top 0.5: v31.3,51.3 31.18,51.18 NDC7002.2 NDC7002.5 27.18,51.18 26.9,50.9 25.96,50.9 AP9930.3 | v31.33,43.5 30.35,43.5 | NDC7002-.2 NDC7002-.5 27.33,43.53 26.9,43.1 AP9930-.3 | 45.5,5.8 41.33,4.1 40.3,3.7 40.72,1.69 39.4,1.46 | 22.61,4.91 17.8,6.8 16.43,5.04 12.8,7.4 9.8,10.1 7.5,12.8 5.2,16.1 4.8,16.85 6.57,18.48 6.6,18.51 | 22.61,4.91 24.92,3.99 25.3,3.8 24.79,1.8 28.66,0.94 29.1,3.5 32.04,5.73 34.14,5.73 36.33,3.54 36.77,1 39.4,1.45 39.4,1.46 | U$23.P$2 4.84,22.62 | 4.84,22.62 4.04,24.61 1.9,24.28 1.08,28 LED.3 3.35,28.3 SI2302.2 5.65,30.6 5.65,34.06 8.31,36.71 A.15 | 6.6,18.51 4.84,22.62 | MOT-ST.2 39.39,1.48 39.4,1.46 | 4.86,43.23 6.4,46.9 | 6.4,46.9 9.9,51.9 14.4,56.4 16.83,58.02 18.9,59.4 22.63,60.97 | 22.63,60.97 24.6,61.8 | 24.6,61.8 24.1,64.1 26.69,64.59 | 26.69,64.59 29.4,65.1 30.26,61.6 31.73,60.13 32.9,60.13 | 32.9,60.13 | 32.9,60.13 34.03,60.13 36,61.8 36.9,64.9 39.41,64.43 | 45.44,59.99 42.3,61.3 40.71,61.99 40.91,64.14 39.41,64.43 | 45.44,59.99 46.6,59.5 47.1,59.3 47.3,59.2 48.7,61.2 53.6,57.8 57.41,54.09 57.77,53.68 61.1,48.6 59.1,47.3 59.89,45.5 | 59.89,45.5 61.5,41.8 61.8,41.2 64,41.6 64.77,37.84 | 64.77,37.84 65.05,36.49 61.94,35.84 60.95,34.86 | 60.95,34.86 60.13,34.04 60.13,31.73 | 60.13,31.73 62.4,29.46 62.4,28.9 61.3,23.6 60,20.37 | 60,20.37 59.4,18.9 56.9,15 53.2,10.9 51.2,9.1 52.5,7.1 49.3,4.9 47.9,7 45.5,5.8 | 60,20.37 U$11.P$2 58.26,21.12 56.07,18.93 B.2 | LED1.3 64.77,37.84 | 26.69,64.59 ENCODER.2 27.08,62.39 27.9,61.56 C2.1 | U$24.P$1 4.86,43.23 | 59.89,45.5 U$18.P$1 56.31,46.87 B.24 53.37,48.87 IRF7905.4 48.61,49.49 47.89,50.21 45.9,50.21
  Top 0.5: U$22.P$2 22.63,60.97 | C3.1 24.6,61.65 24.6,61.8 | U$19.P$2 44.81,58.46 45.44,59.99 | 45.9,50.21 45.52,50.21 44.8,49.49 IRF7905.1 | R25.2 40.56,21.3 IRF7905-.1 | 45.9,50.21 43.59,52.53 43.59,53.58 42.88,54.3 38.9,54.3 33.5,54.3 32.41,55.38 v31.3,55.38 | A.23 6.43,46.87 6.4,46.9 | A.1 7.03,18.93 6.6,18.51 | 28.9,20.4 v28.9,23.9 v22.9,23.9 | 28.9,20.4 28.9,19.9 v25.9,16.9 | IRF7905-.1 37.4,21.3 34.26,21.3 33.45,20.49 28.99,20.49 28.9,20.4 | IRF7905-.1 39.4,20.73 v39.4,19.9 | B.10 58.01,31.73 60.13,31.73 | v59.2,36.6 55.48,36.6 B.16 | v60.4,35.4 60.95,34.86 | 60.95,34.86 | A.9 12.66,30.32 14.7,30.32 17.55,33.18 22.6,33.18 | AD5593.15 27.12,33.18 22.6,33.18 | v22.6,30.9 22.6,33.18 | AD5593.1 44.33,8.58 U$17.P$1 45.47,5.84 45.5,5.8 | U$15.P$1 22.61,4.91 | 5.63,34.04 3.29,36.51 3.9,40.4 4.86,43.23 | PHOTO.2 39.41,64.43
  Top 0.7: R21.2 44.8,47.35 IRF7905.1
  Bottom 0.25: 39.31,18.7 SI2302-.2 | INA.3 24.93,23.59 25.58,24.24 INA.7 INA.8
  Bottom 0.4: INA.8 26.23,26.4 25.9,26.4 | 21.4,23.9 v22.9,23.9 | 30.4,23.9 v28.9,23.9 | 25.9,15.4 v25.9,16.9
  Bottom 0.5: SI2302-.2 37.84,18.67 R9.2 | v31.3,55.38 v31.3,51.3 31.3,48.1 | 31.3,48.1 31.3,43.53 v31.33,43.5 | v33.93,48.1 31.3,48.1 | AD5593.1 44.33,15.97 41.6,18.7 39.31,18.7 39.4,18.79 v39.4,19.9 | v59.2,36.6 v60.4,35.4 | 22.6,26.4 v22.6,30.9
  Bottom 1: 25.9,26.4 30.4,26.4 30.4,23.9 30.4,15.4 29.8,15.4 | 21.4,16.8 21.4,15.4 25.9,15.4 27.6,15.4 | 22.6,26.4 21.4,26.4 21.4,23.9 21.4,19
  pour Top: -5.1,71.9 -5.1,-4.1 71.4,-4.1 71.4,71.9
  pour Bottom: -5.1,71.9 -5.1,-4.1 71.4,-4.1 71.4,71.9
INA_SP+
  Bottom 0.25: R14.1 23.1,20.45 R15.2
  Bottom 0.5: R15.2 20.12,17.9 19.6,17.38 R31.1
LATCH  (via drill 0.35, 0.4)
  Top 0.25: 74HC595-.12 39.73,44.98 v39.7,45 | 74HC595.12 40.16,51.06 v39.7,50.6 | v39.71,35.21 39.48,34.98 16.69,34.98 14.64,32.93 12.73,32.93 A.11
  Bottom 0.25: v39.7,50.6 v39.7,45 v39.7,35.21 v39.71,35.21
LED  (via drill 0.45)
  Top 0.25: R41.1 v8.4,27.66
  Bottom 0.25: v8.4,27.66 8.4,24 10.93,21.47 A.3
MK_MOTOR1+
  Top 0.25: R8.2 31.87,45.12 32.75,46 32.75,50.75 33.71,51.71 74HC595.4
MK_MOTOR1-
  Top 0.25: R18.2 32.05,42.37 32.05,43.6 33.2,44.75 33.2,50.4 33.86,51.06 74HC595.5
MK_MOTOR2+
  Top 0.25: R3.2 32.35,53.01 74HC595.2
MK_MOTOR2-
  Top 0.25: R4.2 31.83,50.62 33.57,52.36 74HC595.3
MOSI  (via drill 0.35)
  Top 0.25: 74HC595.14 41.71,52.36 42.3,51.76 v42.3,51.26
  Bottom 0.25: B.17 51.63,40.46 51.63,42.83 43.2,51.26 v42.3,51.26
MOTOR1+  (via drill 0.4)
  Top 0.5: v23.49,42.8 23.18,43.11 AP9930-.6
  Bottom 0.5: MOT-H.2 26.46,3.46 30.42,7.42 30.42,11.87 32,13.45 32,17.63 35.5,21.13 35.5,37.32 32.67,40.15 24.66,40.15 23.35,41.45 23.35,42.66 v23.49,42.8
MOTOR1-  (via drill 0.4)
  Top 0.5: v24.2,41.8 24.24,41.84 AP9930-.2
  Bottom 0.5: MOT-H.1 32.9,8.01 32.9,13.85 32.7,14.06 32.7,17.34 38.04,22.68 38.04,35.77 32.96,40.85 25.16,40.85 v24.2,41.8
MOTOR2+  (via drill 0.4)
  Top 0.5: v42.4,39.85 42.16,40.09 40.23,40.09 38.63,41.7 33.73,41.7 v33.57,41.55 | v24.31,49.31 22.79,50.83 AP9930.6
  Bottom 0.5: MOT-V.2 46.95,9.74 46.95,15.75 43.58,19.12 43.58,38.73 42.46,39.85 v42.4,39.85 | v33.57,41.55 30.99,41.55 29.67,42.86 29.67,44.75 25.11,49.31 v24.31,49.31
MOTOR2-  (via drill 0.4)
  Top 0.5: v42.4,40.95 41.85,41.5 39.82,41.5 38.92,42.4 v33.01,42.4 | AP9930.2 25.27,49.56 24.2,50.62 v24.2,51.2
  Bottom 0.5: MOT-V.1 47.65,10.78 47.65,16.04 44.28,19.41 44.28,39.25 42.59,40.95 v42.4,40.95 | v24.2,51.2 30.37,45.04 30.37,43.15 31.12,42.4 v33.01,42.4
N$1
  Top 0.25: R1.2 29.56,54.23 30.3,54.23 | 30.3,54.23 R3.1 | NDC7002.3 30.3,52.15 30.3,54.23
N$2
  Top 0.25: 19.7,48.29 AP9930.1 27.54,48.29 R2.1 27.76,50.19 NDC7002.6 | 19.7,48.29 AP9930.8 | R16.1 19.7,46.33 19.7,48.29
N$3
  Top 0.25: R4.1 31.44,48.51 30.3,48.51 | 30.3,48.51 R2.2 | NDC7002.1 30.32,48.53 30.3,48.51
N$4
  Top 0.25: AP9930.4 | AP9930.4 25.88,53.63 R17.1 R1.1 27.55,52.31 NDC7002.4 | AP9930.5 AP9930.4
N$5
  Top 0.25: NDC7002-.6 27.74,42.56 R19.1 | R19.1 27.74,38.61 R5.1 | R19.1 26.05,40.83 AP9930-.1 AP9930-.8
N$6
  Top 0.25: NDC7002-.3 30.22,44.58 30.22,46.01 R7.2 30.44,46.63 R8.1
N$7
  Top 0.25: R19.2 30.3,40.83 | 30.3,40.83 31.49,40.83 R18.1 | 30.3,40.83 30.32,40.85 NDC7002-.1
N$8
  Top 0.25: R7.1 28.3,46.19 27.7,46.19 | 27.7,46.19 R6.1 | AP9930-.5 AP9930-.4 25.89,44.48 NDC7002-.4 27.7,44.5 27.7,46.19
N$9
  Top 0.7: R20.1 47.34,46.92 IRF7905.3
N$12
  Top 0.25: R22.1 R21.1 46.07,46.92 IRF7905.2
N$13
  Bottom 0.5: SI2302-.3 41.28,16.28 39.5,14.5 33.95,14.5 BUZZER.P$1
N$14
  Bottom 0.25: SI2302-.1 37.7,16.78 | 37.7,16.78 R10.2 | R9.1 37.7,16.78
N$15
  Bottom 0.25: R13.2 27.55,21 C1.1 26.23,21.53 INA.1
N$16
  Bottom 0.25: R14.2 24.25,21 C1.2 25.58,21.53 INA.2
N$17
  Top 0.25: SI2302.1 7.7,30.75 R41.2
N$18
  Top 0.25: AD5593.12 38.7,29.21 R27.1
N$20
  Top 0.25: AD5593.11 40.48,29.98 41.1,29.35 R24.1
N$21
  Top 0.25: IRF7905-.2 40.99,22.57 R25.1 R26.1
N$22
  Top 0.25: 74HC595.9 40.26,49.11 40.05,48.89 40.05,46.61 40.38,46.28 74HC595-.14
N$23
  Top 0.25: LED.2 5.08,27.08 SI2302.3 7.25,26.55 R42.2 8.16,25.9 10.18,27.92 10.18,34.78 10.83,35.43 38.4,35.43 38.91,35.94 51.37,35.94 51.88,35.43 59.22,35.43 62.53,38.73 LED1.2
PERE1
  Top 0.25: R22.2 44.25,42.76 44.02,42.52 40.24,42.52 38.45,44.31 38.45,48.07 36.11,50.41 74HC595.6
PERE1_G
  Top 0.25: 44.9,55.33 IRF7905.8
  Top 0.6: IRF7905.7 46.07,54.25 46.37,53.94 49.58,53.94 50.22,54.58 53.61,54.58 PER-PAR.1
  Top 0.7: IRF7905.7 44.9,55.33
PERE2
  Top 0.25: 74HC595.7 36.13,49.76 38,47.89 38,44.13 40.05,42.07 44.83,42.07 46.78,44.02 46.78,44.03 R23.2
PERE2_G
  Top 0.6: PER-ST.1 48.61,58.14 IRF7905.5
  Top 0.7: IRF7905.5 IRF7905.6
PERE3  (via drill 0.35)
  Top 0.25: 74HC595.15 42.24,53.01 v42.3,53.02 | v42.3,25.6 41.15,25.6 R26.2
  Bottom 0.25: v42.3,53.02 42.17,53.02 41.1,51.94 41.1,39.48 42.56,38.03 42.56,25.86 v42.3,25.6
PERE3_G
  Top 0.5: IRF7905-.8 IRF7905-.7 32.99,22.57 33.71,23.29 33.71,25.66 33.45,25.92 32.7,25.92 30.31,28.3 19.21,28.3 18.49,27.58 18.49,20.93 14.79,17.24 11.18,17.24 PER-SP.1
SCK  (via drill 0.35)
  Top 0.25: v42.3,44.45 42.17,44.3 41.03,44.3 74HC595-.11 | 74HC595.11 42.2,50.41 v42.3,50.3
  Bottom 0.25: v42.3,50.3 v42.3,44.45 49.36,44.45 51.18,42.63 51.18,39.07 52.28,37.97 53.42,37.97 54.12,37.26 54.12,35.46 B.13
SCL
  Top 0.25: B.7 51.46,27.93 34.83,27.93 R29.2 33.9,28.93 AD5593.14
  Bottom 0.25: AD5593.14 31.63,29.63 30.4,28.4 25.9,28.4 24.28,26.78 INA.5
SDA
  Top 0.25: B.8 54.09,27.84 52.27,27.84 47.06,33.05 36.02,33.05 AD5593.13 36.3,29.07 R28.2
  Bottom 0.25: AD5593.13 34.17,29.67 32.4,27.9 26.04,27.9 24.93,26.79 INA.6
SP+
  Bottom 0.25: R15.1 28.9,18.1 R13.1
  Bottom 0.5: SP.1 19.4,10.29 19.4,12.9 20.4,13.9 27.9,13.9 28.7,14.7 R15.1
SP-
  Bottom 0.5: R31.2 19.6,18.6 18.4,17.4 18.4,10.9 15.43,7.93 SP.2
SWITCH  (via drill 0.35)
  Top 0.25: R40.1 51.35,40.5 v54.1,40.5
  Bottom 0.25: v54.1,40.5 54.1,43.06 B.22
TRUBKI  (via drill 0.35)
  Top 0.25: v38.2,53.1 37.64,53.66 74HC595.1
  Bottom 0.25: v38.2,53.1 38.7,53.1 40.65,51.16 40.65,39.3 42.11,37.84 42.11,26.4 41.6,25.9 41.6,19.52 45.42,15.7 45.42,9.4 45.42,9.39 40.93,4.9 39.17,4.9 37.85,3.59 MOT-ST.1
VAB  (via drill 0.45)
  Top 0.5: B.9 47.58,34.35 17.17,34.35 v16.97,34.16
  Bottom 0.5: v16.97,34.16 16.97,34.36 14.62,36.71 A.16
  Bottom 0.6: B.9 54.11,30.37 55.9,30.37 57.14,31.61 57.14,47.6 PER-PAR.2 58.54,51.53 52.95,57.13 PER-ST.2 | PER-SP.2 7.27,31.79 10.91,35.44 12.7,35.44 A.16

### Text on the board
bNames: ENCODER | PHOTO | PER-ST | PER-PAR | LED1